# Altium schematic sheet Endstop Channel.SchDoc
size A
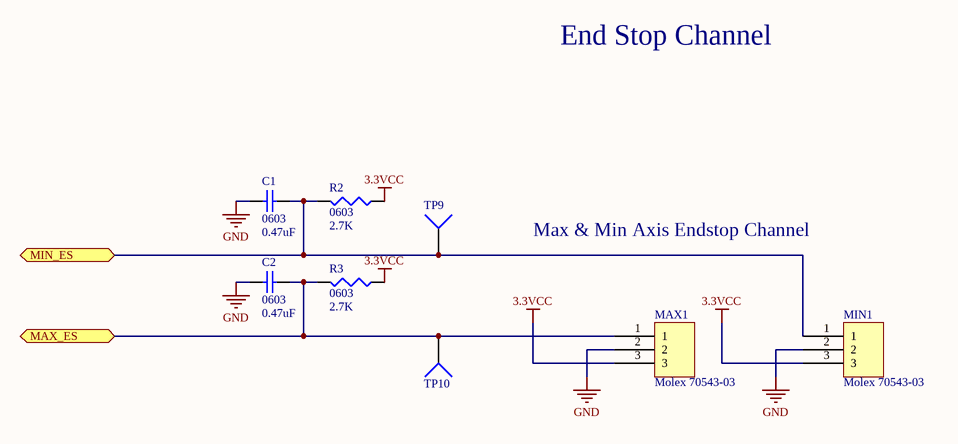
[diagram p0: Endstop Channel.SchDoc]

## Parts
C1  0603  value 0.47uF  [1608[0603]]
C2  0603  value 0.47uF  [1608[0603]]
MAX1  Molex 70543-03  [70543-03]
MIN1  Molex 70543-03  [70543-03]
R2  0603  value 2.7K  [J1-0603]
R3  0603  value 2.7K  [J1-0603]
TP9  TP4  [TP-2]  (value not drawn)
TP10  TP4  [TP-2]  (value not drawn)

## Ports
MAX_ES, MIN_ES

## Nets
3.3VCC: MAX1.3 MIN1.3 R2.1 R3.1
GND: C1.2 C2.2 MAX1.2 MIN1.2
MAX_ES: C2.1 MAX1.1 R3.2 TP10.1 ; port MAX_ES
MIN_ES: C1.1 MIN1.1 R2.2 TP9.1 ; port MIN_ES

## Notes on the sheet
- End Stop Channel
- Max & Min Axis Endstop Channel

## Library data of the parts
C1 C2 = Cap Semi: Capacitor (Semiconductor SIM Model); Published: 8-Jun-2000; LatestRevisionDate: 29-May-2009; LatestRevisionNote: IPC-7351 Footprint Added.; PackageReference: C1206; Publisher: Altium Limited; PackageDescription: Chip Capacitor
MAX1 MIN1 = Molex Endstop
R2 R3 = Res3: Resistor; Published: 8-Jun-2000; LatestRevisionDate: 29-May-2009; LatestRevisionNote: IPC-7351 Footprint Added.; PackageReference: J1-0603; Publisher: Altium Limited; PackageDescription: Chip Resistor
TP9 TP10 = Socket: LatestRevisionDate: 17-Jul-2002; LatestRevisionNote: Re-released for DXP Platform.; Publisher: Altium Limited